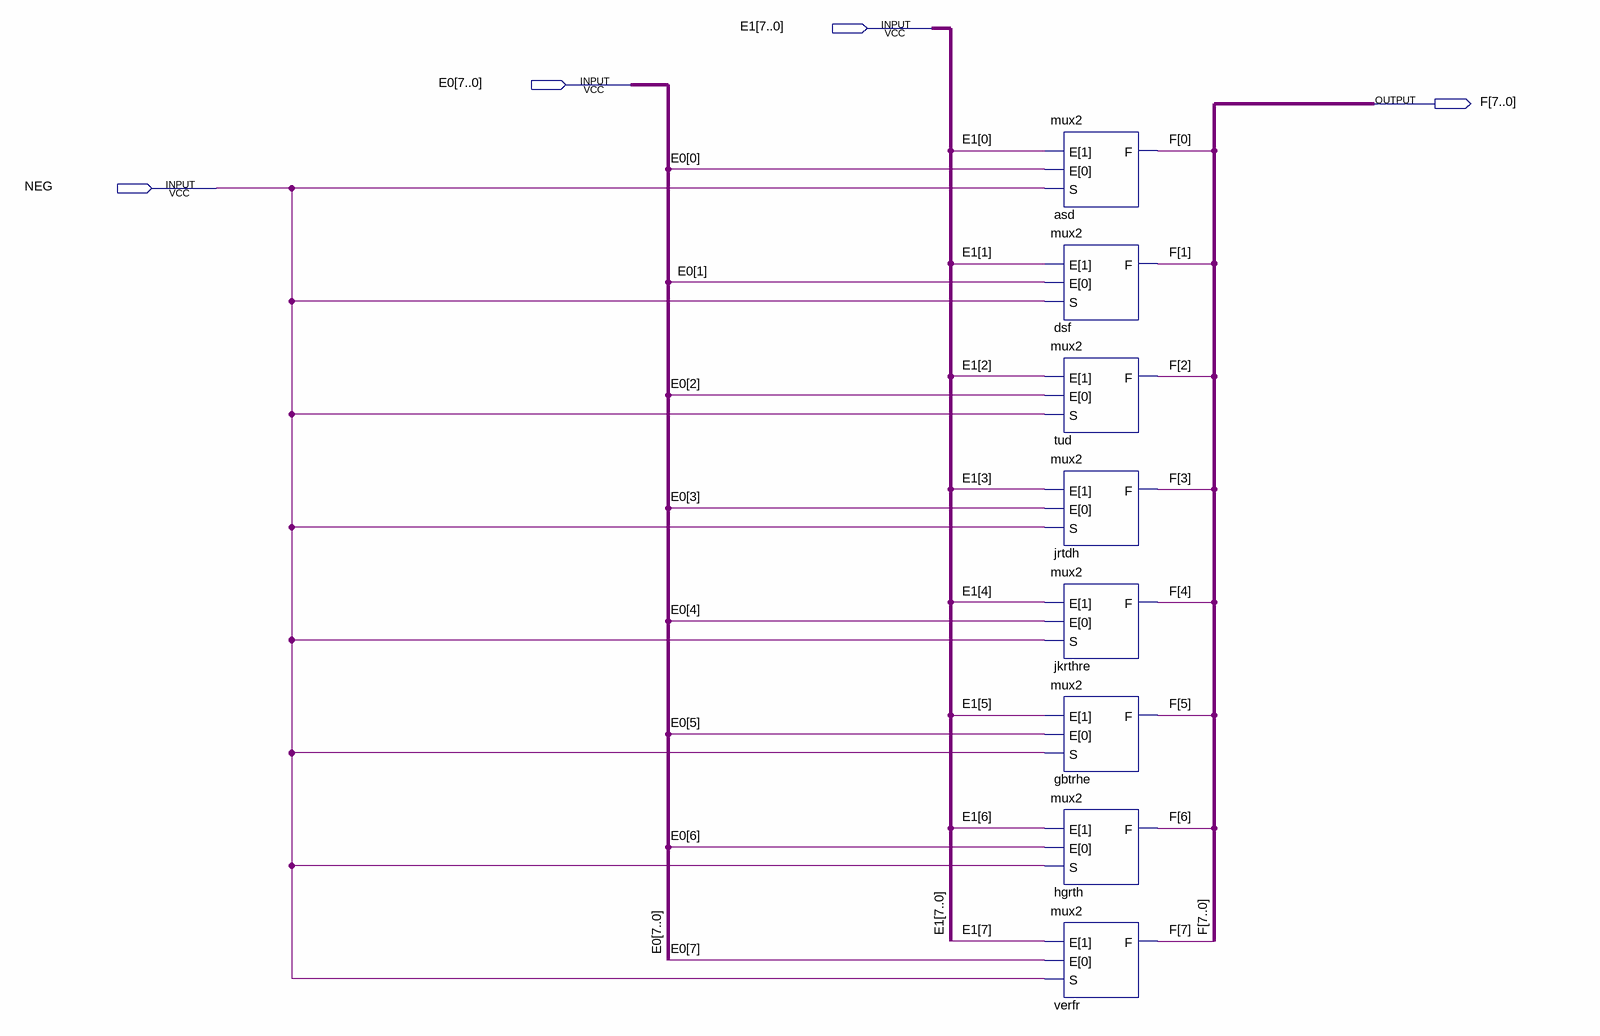
[diagram p0: schematic sheet]
// Quartus schematic mux.bdf as structural Verilog: 8 symbols, 4 pins
module mux (
  input  [7:0] E1,
  input  [7:0] E0,
  input  NEG,
  output [7:0] F
);

  mux2 asd (.E({E1[0], E0[0]}), .S(NEG), .F(F[0]));
  mux2 dsf (.E({E1[1], E0[1]}), .S(NEG), .F(F[1]));
  mux2 tud (.E({E1[2], E0[2]}), .S(NEG), .F(F[2]));
  mux2 jrtdh (.E({E1[3], E0[3]}), .S(NEG), .F(F[3]));
  mux2 jkrthre (.E({E1[4], E0[4]}), .S(NEG), .F(F[4]));
  mux2 gbtrhe (.E({E1[5], E0[5]}), .S(NEG), .F(F[5]));
  mux2 hgrth (.E({E1[6], E0[6]}), .S(NEG), .F(F[6]));
  mux2 verfr (.E({E1[7], E0[7]}), .S(NEG), .F(F[7]));
endmodule
